# Altium schematic sheet Audio.SchDoc: Audio
size A4; DocumentNumber: MB1219; Revision: B.1; SheetNumber: 5; SheetTotal: 17; Project: STM32F769I-EVAL
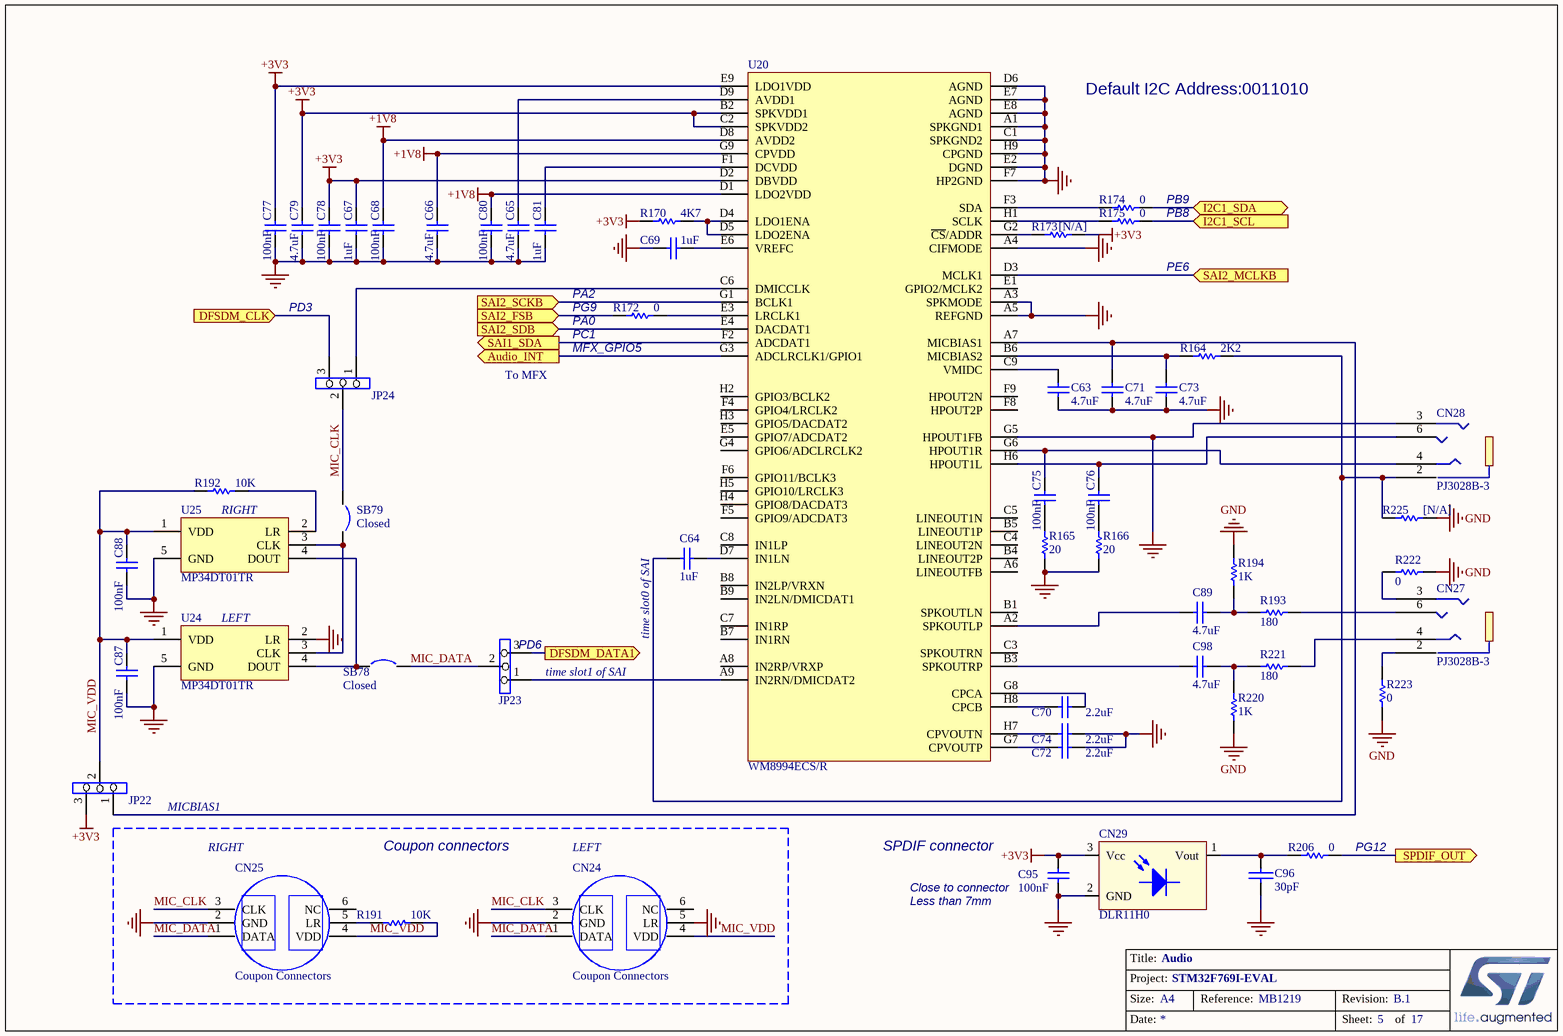
[diagram p0: Audio.SchDoc]

## Parts
C63  4.7uF  [0603C]
C64  1uF  [0603C]
C65  4.7uF  [0603C]
C66  4.7uF  [0603C]
C67  1uF  [0603C]
C68  100nF  [0603C]
C69  1uF  [0603C]
C70  2.2uF  [0603C]
C71  4.7uF  [0603C]
C72  2.2uF  [0603C]
C73  4.7uF  [0603C]
C74  2.2uF  [0603C]
C75  100nF  [0603C]
C76  100nF  [0603C]
C77  100nF  [0603C]
C78  100nF  [0603C]
C79  4.7uF  [0603C]
C80  100nF  [0603C]
C81  1uF  [0603C]
C87  100nF  [0603C]
C88  100nF  [0603C]
C89  4.7uF  [0603C]
C95  100nF  [0603C]
C96  30pF  [0603C]
C98  4.7uF  [0603C]
CN24  Coupon Connectors  [Coupon]
CN25  Coupon Connectors  [Coupon]
CN27  PJ3028B-3  [PJ3028B]
CN28  PJ3028B-3  [PJ3028B]
CN29  DLR11H0  [CONN_DLR11H0]
JP22  (no value)  [SIP3]
JP23  (no value)  [SIP3]
JP24  (no value)  [SIP3]
R164  2K2  [0603R]
R165  20  [0603R]
R166  20  [0603R]
R170  4K7  [0603R]
R172  0  [0603R]
R173  [N/A]  [0603R]
R174  0  [0603R]
R175  0  [0603R]
R191  10K  [0603R]
R192  10K  [0603R]
R193  180  [0402R]
R194  1K  [0402R]
R206  0  [0603R]
R220  1K  [0402R]
R221  180  [0402R]
R222  0  [0603R]
R223  0  [0603R]
R225  [N/A]  [0603R]
SB78  Closed  [SB_0603]
SB79  Closed  [SB_0603]
U20  WM8994ECS/R  [BGA72_0R5_4R5X4]
U24  MP34DT01TR  [MP34DT01TR]
U25  MP34DT01TR  [MP34DT01TR]

## Blocks framed on the sheet
Coupon connectors: CN24 CN25 R191

## Ports
Audio_INT (out), DFSDM_CLK (in), DFSDM_DATA1 (out), I2C1_SCL (in), I2C1_SDA (bidir), SAI1_SDA (out), SAI2_FSB (in), SAI2_MCLKB (in), SAI2_SCKB (in), SAI2_SDB (in), SPDIF_OUT (out)

## Nets
+1V8: C66.1 C68.1 C80.1 U20.D1(LDO2VDD) U20.D8(AVDD2) U20.G9(CPVDD)
+3V3: C67.1 C77.1 C78.1 C79.1 C95.2 CN29.3(Vcc) JP22.3 R170.2 R173.1 U20.B2(SPKVDD1) U20.C2(SPKVDD2) U20.D2(DBVDD) U20.E9(LDO1VDD)
GND: C63.1 C65.2 C66.2 C67.2 C68.2 C69.2 C71.1 C72.2 C73.1 C74.2 C77.2 C78.2 C79.2 C80.2 C81.2 C87.2 C88.2 C95.1 C96.2 CN24.2(GND) CN24.5(LR) CN25.2(GND) CN28.3 CN29.2(GND) R165.2 R166.2 R194.2 R220.1 R222.2 R223.2 R225.1 U20.A1(SPKGND1) U20.A3(SPKMODE) U20.A4(CIFMODE) U20.A5(REFGND) U20.C1(SPKGND2) U20.D6(AGND) U20.E2(DGND) U20.E7(AGND) U20.E8(AGND) U20.F7(HP2GND) U20.G5(HPOUT1FB) U20.H9(CPGND) U24.2(LR) U24.5(GND) U25.5(GND)
Audio_INT: U20.G3(ADCLRCLK1/GPIO1) ; port Audio_INT
DFSDM_CLK: JP24.3 ; port DFSDM_CLK
DFSDM_DATA1: JP23.3 ; port DFSDM_DATA1
I2C1_SCL: R175.1 ; port I2C1_SCL
I2C1_SDA: R174.1 ; port I2C1_SDA
MIC_CLK: CN24.3(CLK) CN25.3(CLK) JP24.2 SB79.1
MIC_DATA: CN24.1(DATA) CN25.1(DATA) JP23.2 SB78.2
MIC_VDD: C87.1 C88.1 CN24.4(VDD) CN25.4(VDD) JP22.2 R191.2 R192.2 U24.1(VDD) U25.1(VDD)
SAI1_SDA: U20.F2(ADCDAT1) ; port SAI1_SDA
SAI2_FSB: R172.2 ; port SAI2_FSB
SAI2_MCLKB: U20.D3(MCLK1) ; port SAI2_MCLKB
SAI2_SCKB: U20.G1(BCLK1) ; port SAI2_SCKB
SAI2_SDB: U20.E4(DACDAT1) ; port SAI2_SDB
SPDIF_OUT: R206.1 ; port SPDIF_OUT
NetC63_2: C63.2 U20.C9(VMIDC)
NetC64_1: C64.1 U20.D7(IN1LN)
NetC64_2: C64.2 CN28.2 R164.1 R225.2
NetC65_1: C65.1 U20.D9(AVDD1)
NetC69_1: C69.1 U20.E6(VREFC)
NetC70_1: C70.1 U20.H8(CPCB)
NetC70_2: C70.2 U20.G8(CPCA)
NetC71_2: C71.2 JP22.1 U20.A7(MICBIAS1)
NetC72_1: C72.1 U20.G7(CPVOUTP)
NetC73_2: C73.2 R164.2 U20.B6(MICBIAS2)
NetC74_1: C74.1 U20.H7(CPVOUTN)
NetC75_1: C75.1 CN28.4 U20.G6(HPOUT1R)
NetC75_2: C75.2 R165.1
NetC76_1: C76.1 CN28.6 U20.H6(HPOUT1L)
NetC76_2: C76.2 R166.1
NetC81_1: C81.1 U20.F1(DCVDD)
NetC89_1: C89.1 R193.1 R194.1
NetC89_2: C89.2 U20.A2(SPKOUTLP)
NetC96_1: C96.1 CN29.1(Vout) R206.2
NetC98_1: C98.1 R220.2 R221.2
NetC98_2: C98.2 U20.B3(SPKOUTRP)
NetCN25_5: CN25.5(LR) R191.1
NetCN27_2: CN27.2 R223.1
NetCN27_3: CN27.3 R222.1
NetCN27_4: CN27.4 R221.1
NetCN27_6: CN27.6 R193.2
NetJP23_1: JP23.1 U20.A9(IN2RN/DMICDAT2)
NetJP24_1: JP24.1 U20.C6(DMICCLK)
NetR170_1: R170.1 U20.D4(LDO1ENA) U20.D5(LDO2ENA)
NetR172_1: R172.1 U20.E3(LRCLK1)
NetR173_2: R173.2 U20.G2(~{CS}/ADDR)
NetR174_2: R174.2 U20.F3(SDA)
NetR175_2: R175.2 U20.H1(SCLK)
NetR192_1: R192.1 U25.2(LR)
NetSB78_1: SB78.1 U24.4(DOUT) U25.4(DOUT)
NetSB79_2: SB79.2 U24.3(CLK) U25.3(CLK)

Not connected (* = marked no-connect by the designer): CN24 6(NC); CN25 6(NC); U20 A6(LINEOUTFB) A8(IN2RP/VRXP) B1(SPKOUTLN) B4(LINEOUT2P) B5(LINEOUT1P) B7(IN1RN) B8(IN2LP/VRXN) B9(IN2LN/DMICDAT1) C3(SPKOUTRN) C4(LINEOUT2N) C5(LINEOUT1N) C7(IN1RP) C8(IN1LP) E1(GPIO2/MCLK2) E5(GPIO7/ADCDAT2) F4(GPIO4/LRCLK2) F5(GPIO9/ADCDAT3) F6(GPIO11/BCLK3) F8(HPOUT2P) F9(HPOUT2N) G4(GPIO6/ADCLRCLK2) H2(GPIO3/BCLK2) H3(GPIO5/DACDAT2) H4(GPIO8/DACDAT3) H5(GPIO10/LRCLK3)

## Notes on the sheet
- Default I2C Address:0011010
- PB9
- PB8
- PD3
- PA2
- (near R172) PG9
- PE6
- To MFX
- (near R172) PA0
- (near R172) PC1
- (near R172) MFX_GPIO5
- RIGHT
- (near U24) LEFT
- (near JP23) PD6
- (near C64) time slot0 of SAI
- (near JP23) time slot1 of SAI
- MICBIAS1
- LEFT
- SPDIF connector
- (near R206) PG12
- (near C95) Close to connector
- Less than 7mm
- Title:
- Project:
- Size:
- Date:
- A4
- Reference:
- Sheet:
- Revision:
- of

## Library data of the parts
C63 C65 C66 C68 C71 C73 C75-C80 C87 C88 C95 = Cap: Capacitor; Value: 10nF; Published: 8-Jun-2000; Revision: July-2002: Re-released for DXP Platform.; Publisher: Altium Limited
C64 C67 C69 C70 C72 C74 C81 = CAP: Capacitor; Value: 100nF; Published: 8-Jun-2000; Revision: July-2002: Re-released for DXP Platform.; Publisher: Altium Limited
C89 C98 = Cap: Capacitor; Value: 10nF; Ordered by: Subcon; Published: 8-Jun-2000; Revision: July-2002: Re-released for DXP Platform.; Publisher: Altium Limited
C96 = CAP: Capacitor
CN24 CN25 = Coupon Connectors: Header, 3-Pin, Single row; Revision: 17-Jul-2002: Re-released for DXP Platform.; Publisher: Altium Limited
CN29 = OPTO
JP22-JP24 = Jumper3
R164-R166 R170 R172-R175 R191 R192 R206 R225 = Res1: Resistor; Value: 1K; Published: 8-Jun-2000; Revision: July-2002: Re-released for DXP Platform.; Publisher: Altium Limited
R193 R221-R223 = Res1: Resistor; Value: 1K; Ordered by: Subcon; Published: 8-Jun-2000; Revision: July-2002: Re-released for DXP Platform.; Publisher: Altium Limited
R194 R220 = Res1: Resistor; Ordered by: Subcon; Published: 8-Jun-2000; Revision: July-2002: Re-released for DXP Platform.; Publisher: Altium Limited; Value: 1K
SB78 SB79 = Circuit Breaker_close: Circuit Breaker; Published: 24-Mar-1999; Revision: July-2002: Re-released for DXP Platform.; Publisher: Altium Limited
U24 U25 = MP34DT01TR: MEMS audio sensor; Revision: 17-Jul-2002: Re-released for DXP Platform.; Publisher: Altium Limited